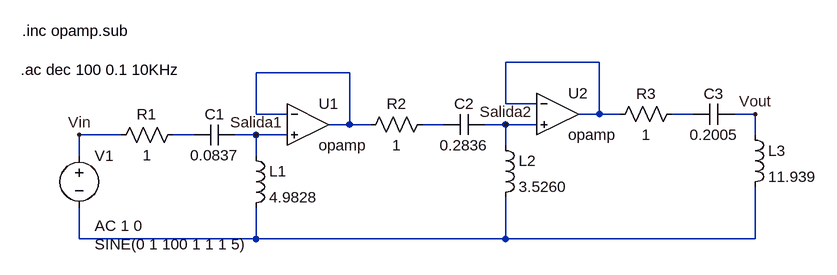
[diagram p0: schematic Draft4.asc]
Draft4.asc, the LTspice schematic file:
Version 4
SHEET 1 1112 680
WIRE 768 0 624 0
WIRE 384 16 240 16
WIRE 624 64 624 0
WIRE 672 64 624 64
WIRE 240 80 240 16
WIRE 288 80 240 80
WIRE 768 80 768 0
WIRE 768 80 736 80
WIRE 800 80 768 80
WIRE 912 80 880 80
WIRE 1008 80 976 80
WIRE 384 96 384 16
WIRE 384 96 352 96
WIRE 416 96 384 96
WIRE 528 96 496 96
WIRE 624 96 592 96
WIRE 672 96 624 96
WIRE 32 112 -32 112
WIRE 144 112 112 112
WIRE 240 112 208 112
WIRE 288 112 240 112
WIRE 1008 112 1008 80
WIRE 624 128 624 96
WIRE -32 144 -32 112
WIRE 240 144 240 112
WIRE -32 272 -32 224
WIRE 240 272 240 224
WIRE 240 272 -32 272
WIRE 624 272 624 208
WIRE 624 272 240 272
WIRE 1008 272 1008 192
WIRE 1008 272 624 272
FLAG 1008 80 Vout
FLAG -32 112 Vin
FLAG 240 112 Salida1
FLAG 624 96 Salida2
SYMBOL res 128 96 R90
WINDOW 0 0 56 VBottom 2
WINDOW 3 32 56 VTop 2
SYMATTR InstName R1
SYMATTR Value 1
SYMBOL res 512 80 R90
WINDOW 0 0 56 VBottom 2
WINDOW 3 32 56 VTop 2
SYMATTR InstName R2
SYMATTR Value 1
SYMBOL res 896 64 R90
WINDOW 0 0 56 VBottom 2
WINDOW 3 32 56 VTop 2
SYMATTR InstName R3
SYMATTR Value 1
SYMBOL cap 208 96 R90
WINDOW 0 0 32 VBottom 2
WINDOW 3 32 32 VTop 2
SYMATTR InstName C1
SYMATTR Value 0.0837
SYMBOL cap 528 112 R270
WINDOW 0 32 32 VTop 2
WINDOW 3 0 32 VBottom 2
SYMATTR InstName C2
SYMATTR Value 0.2836
SYMBOL cap 976 64 R90
WINDOW 0 0 32 VBottom 2
WINDOW 3 32 32 VTop 2
SYMATTR InstName C3
SYMATTR Value 0.2005
SYMBOL ind 224 128 R0
SYMATTR InstName L1
SYMATTR Value 4.9828
SYMBOL ind 608 112 R0
SYMATTR InstName L2
SYMATTR Value 3.5260
SYMBOL ind 992 96 R0
SYMATTR InstName L3
SYMATTR Value 11.939
SYMBOL OpAmps\\opamp 320 32 R0
SYMATTR InstName U1
SYMBOL OpAmps\\opamp 704 16 R0
SYMATTR InstName U2
SYMBOL voltage -32 128 R0
WINDOW 3 24 152 Left 2
WINDOW 123 24 124 Left 2
WINDOW 39 0 0 Left 0
SYMATTR InstName V1
SYMATTR Value SINE(0 1 100 1 1 1 5)
SYMATTR Value2 AC 1 0
TEXT -120 -48 Left 2 !.inc opamp.sub
TEXT -122 12 Left 2 !.ac dec 100 0.1 10KHz

The netlist it stands for:
* Draft4.asc
R1 N005 Vin 1
R2 N004 N002 1
R3 N003 N001 1
C1 Salida1 N005 0.0837
C2 N004 Salida2 0.2836
C3 Vout N003 0.2005
L1 Salida1 N006 4.9828
L2 Salida2 N006 3.5260
L3 Vout N006 11.939
XU1 N002 Salida1 N002 opamp Aol=100K GBW=10Meg  ; pins invin noninvin out
XU2 N001 Salida2 N001 opamp Aol=100K GBW=10Meg  ; pins invin noninvin out
V1 Vin N006 SINE(0 1 100 1 1 1 5) AC 1 0
.inc opamp.sub
.ac dec 100 0.1 10KHz
.backanno
.end